# EAGLE design esptoy_v124 (EAGLE 7.3.0)
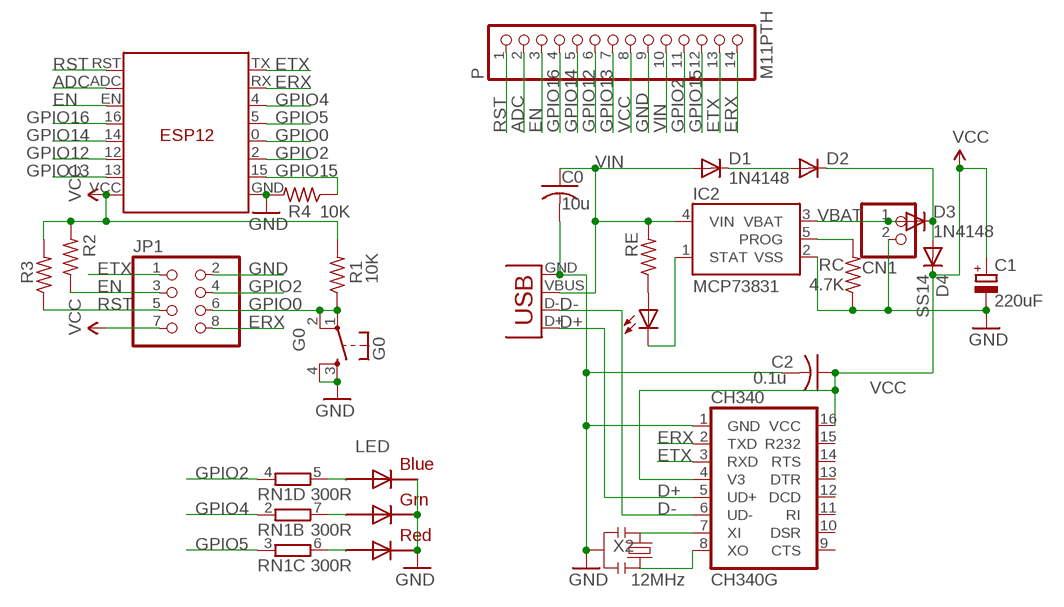
[diagram p0: schematic, sheet 1]

## Parts
C0  10u  C-USC0805K  [C0805K]
C1  220uF  CPOL-EUD  [PANASONIC_D]
C2  0.1u  C-USC0603K  [C0603K]
CH340  CH340G  [SO16]
CHG  0805  LEDCHIPLED_0805  [CHIPLED_0805]
CN1  JST_2PIN-SMT-RA  [JST-PH-2-SMT-RA]
D1  1N4148  DIODE-MINIMELF  [MINIMELF]
D2  DIODE-MINIMELF  [MINIMELF]
D3  1N4148  DIODE-MINIMELF  [MINIMELF]
D4  SS14  DIODE-DO-214AC  [DO-214AC]
G0  G0  TAC_SWITCHSMD  [TACTILE_SWITCH_SMD]
IC2  MCP73831  [SOT23-5]
JP1  PINHD-2X4  [2X04]
LED  RGBLED5050  [RGBLED5050]
P  M11PTH  PINHD-1X14-CB  [1X14-CB]
R1  10K  R-US_R0603  [R0603]
R2  R-US_R0603  [R0603]
R3  R-US_R0603  [R0603]
R4  10K  R-US_R0603  [R0603]
RC  4.7K  R-US_R0805  [R0805]
RE  R-US_R0603  [R0603]
RN1  300R  4R-NEXB38V  [EXB38V]
U$1  ESP12  [ESP12]
X2  12MHz  RESONATORSMD  [RESONATOR-SMD]
X3  USB-MICROB  [USB-MICROB]

## Nets
ADC: P.2 U$1.ADC
D+: CH340.5(UD+) X3.D+
D-: CH340.6(UD-) X3.D-
EN: JP1.3 P.3 R2.1 U$1.EN
ERX: CH340.2(TXD) JP1.8 P.14 U$1.RX
ETX: CH340.3(RXD) JP1.1 P.13 U$1.TX
GND: C0.2 C1.- C2.2 CH340.1(GND) CN1.2 G0.3 G0.4 IC2.2(VSS) JP1.2 LED.4(BLUE_C) LED.5(RED_C) LED.6(GREEN_C) P.9 R4.2 RC.1 U$1.GND X2.2 X3.GND
GPIO0: G0.1 G0.2 JP1.6 R1.1 U$1.0(G0)
GPIO2: JP1.4 P.11 RN1.4 U$1.2(G2)
GPIO4: RN1.2 U$1.4(G4)
GPIO5: RN1.3 U$1.5(G5)
GPIO12: P.6 U$1.12(G12)
GPIO13: P.7 U$1.13(G13)
GPIO14: P.5 U$1.14(G14)
GPIO15: P.12 R4.1 U$1.15(G15)
GPIO16: P.4 U$1.16(G16)
N$1: D1.C D2.A
N$2: LED.3(BLUE_A) RN1.5
N$3: IC2.5(PROG) RC.2
N$4: CHG.A RE.1
N$5: CHG.C IC2.1(STAT)
N$6: LED.1(GREEN_A) RN1.7
N$7: LED.2(RED_A) RN1.6
N$8 [power]: D2.C D3.C D4.A
N$11: CH340.7(XI) X2.1
N$13: CH340.8(XO) X2.3
RST: JP1.5 P.1 R3.1 U$1.RST
VBAT [power]: CN1.1 D3.A IC2.3(VBAT)
VCC [power]: C1.+ C2.1 CH340.4(V3) CH340.16(VCC) D4.C JP1.7 P.8 R1.2 R2.2 R3.2 U$1.VCC
VIN [power]: C0.1 D1.A IC2.4(VIN) P.10 RE.2 X3.VBUS
Unconnected: CH340.9(CTS) CH340.10(DSR) CH340.11(RI) CH340.12(DCD) CH340.13(DTR) CH340.14(RTS) CH340.15(R232) RN1.1 RN1.8

## Library data of the parts
C0 = adafruit2013:C-US: CAPACITOR, American symbol
C1 = rcl:CPOL-EU: POLARIZED CAPACITOR, European symbol
C2 = adafruit:C-US: CAPACITOR, American symbol
CH340 = SparkFunNew:CH340
CHG = led:LED: LED OSRAM: - CHIPLED LG R971, LG N971, LY N971, LG Q971, LY Q971, LO R971, LY R971 LH N974, LH R974 LS Q976, LO Q976, LY Q976 LO Q996 - Hyper CHIPLED LW Q18S LB Q993, LB Q99A, LB R99A - SideLED LS A670, LO A670, LY A670, LG A670, LP A670 LB A673, LV A673, LT A673, LW A673 LH A674 LY A675 LS A676, LA A676, LO A676, LY A676, LW A676 LS A679, LY A679, LG A679 - Hyper Micro SIDELED® LS Y876, LA Y876, LO Y876, LY Y876 LT Y87S - SmartLED LW L88C, LW L88S LB L89C, LB L89S, LG L890 LS L89K, LO L89K, LY L89K LS L896, LA L896, LO L896, LY L896 - TOPLED LS T670, LO T670, LY T670, LG T670, LP T670 LSG T670, LSP T670, LSY T670, LOP T670, LYG T670 LG T671, LOG T671, LSG T671 LB T673, LV T673, LT T673, LW T673 LH T674 LS T676, LA T676, LO T676, LY T676, LB T676, LH T676, LSB T676, LW T676 LB T67C, LV T67C, LT T67C, LS T67K, LO T67K, LY T67K, LW E67C LS E67B, LA E67B, LO E67B, LY E67B, LB E67C, LV E67C, LT E67C LW T67C LS T679, LY T679, LG T679 LS T770, LO T770, LY T770, LG T770, LP T770 LB T773, LV T773, LT T773, LW T773 LH T774 LS E675, LA E675, LY E675, LS T675 LS T776, LA T776, LO T776, LY T776, LB T776 LHGB T686 LT T68C, LB T68C - Hyper Mini TOPLED® LB M676 - Mini TOPLED Santana® LG M470 LS M47K, LO M47K, LY M47K Source: http://www.osram.convergy.de LUXEON: - LUMILED® LXK2-PW12-R00, LXK2-PW12-S00, LXK2-PW14-U00, LXK2-PW14-V00 LXK2-PM12-R00, LXK2-PM12-S00, LXK2-PM14-U00 LXK2-PE12-Q00, LXK2-PE12-R00, LXK2-PE12-S00, LXK2-PE14-T00, LXK2-PE14-U00 LXK2-PB12-K00, LXK2-PB12-L00, LXK2-PB12-M00, LXK2-PB14-N00, LXK2-PB14-P00, LXK2-PB14-Q00 LXK2-PR12-L00, LXK2-PR12-M00, LXK2-PR14-Q00, LXK2-PR14-R00 LXK2-PD12-Q00, LXK2-PD12-R00, LXK2-PD12-S00 LXK2-PH12-R00, LXK2-PH12-S00 LXK2-PL12-P00, LXK2-PL12-Q00, LXK2-PL12-R00 Source: www.luxeon.com KINGBRIGHT: KA-3528ASYC Source: www.kingbright.com
CN1 = adafruit:JST_2PIN: JST 2-Pin Connectors of various flavors SMT-RA (S2B-PH-SM4) 4UConnector #17311 SMT (B2B-PH-SM4) THM-RA (S2B-PH) THM (B2B-PH)
D1-D4 = diode:DIODE-: DIODE
G0 = SparkFunNew:TAC_SWITCH: Momentary Switch Button commonly used for reset or general input. Spark Fun Electronics SKU : COM-00097
IC2 = SparkFunNew:MCP73831: Microchip's MCP73831 Miniature single cell, fully integrated Li-Ion, Li-polymer charge management controller http://ww1.microchip.com/downloads/en/DeviceDoc/21984a.pdf
JP1 = pinhead:PINHD-2X4: PIN HEADER
LED = adafruit:RGBLED: For 5050 RGB LEDs, the order of the LEDs may vary from one manufacturer to another!
P = adafruit:PINHD-1X14: PIN HEADER
R1-R4 RE = adafruit (picker 的冲突副本 2014-10-29):R-US_: RESISTOR, American symbol
RC = adafruit2013:R-US_: RESISTOR, American symbol
RN1 = resistor-dil:4R-N: Array Chip Resistor Source: RS Component / Phycomp; OC_FARNELL: unknown; OC_NEWARK: unknown
U$1 = JeeParts:ESP12
X2 = SparkFunNew:RESONATOR: Resonator Small SMD resonator. This is the itty bitty 10/20MHz resonators with built in caps. CSTCE10M0G55 and CSTCE20M0V53. Footprint has been reviewed closely but hasn't been tested yet.
X3 = SparkFunNew:USB: USB Connectors USB-B-PTH is fully proven SKU : PRT-00139 USB-miniB is fully proven SKU : PRT-00587 USB-A-PCB is untested. USB-A-H is throughly reviewed, but untested. Spark Fun Electronics SKU : PRT-00437 USB-B-SMT is throughly reviewed, but untested. Needs silkscreen touching up. USB-A-S has not been used/tested USB-MB-H has not been used/tested

## Net classes
0 default: width 0.178 mm, clearance 0.178 mm
1 power: width 0.254 mm, clearance 0.178 mm

## Board
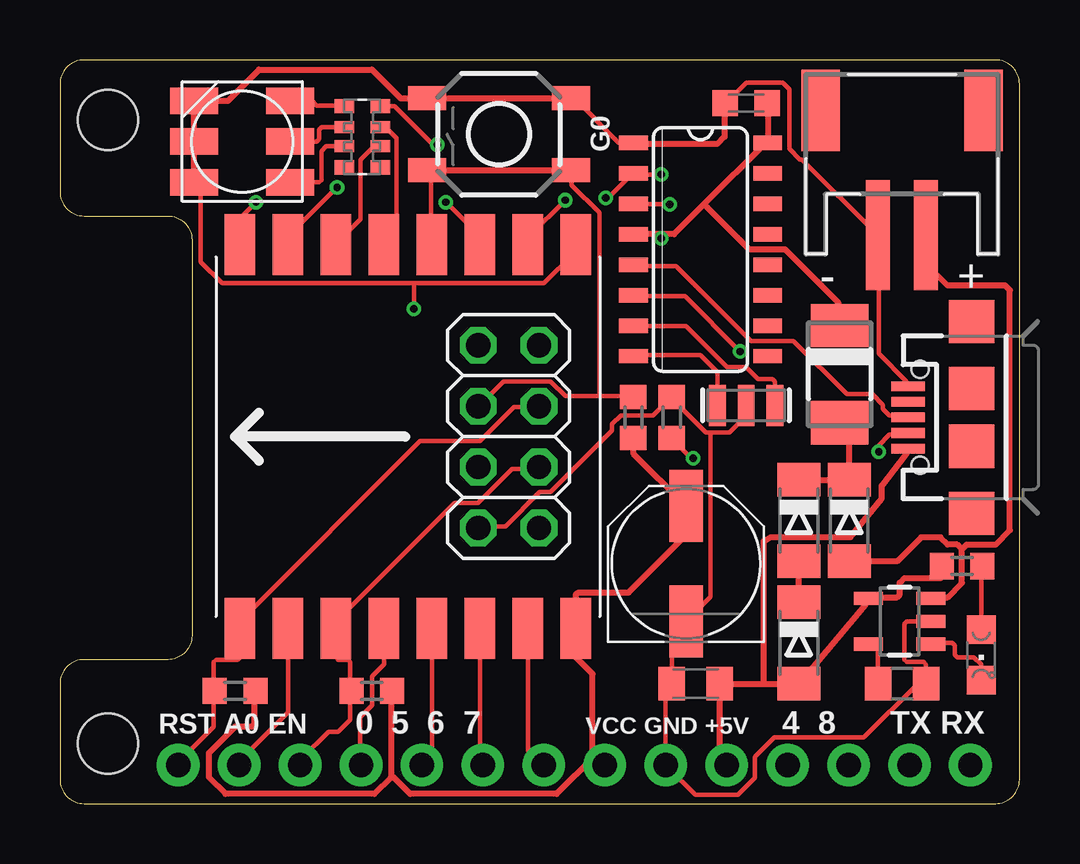
[diagram p1: board, top side]
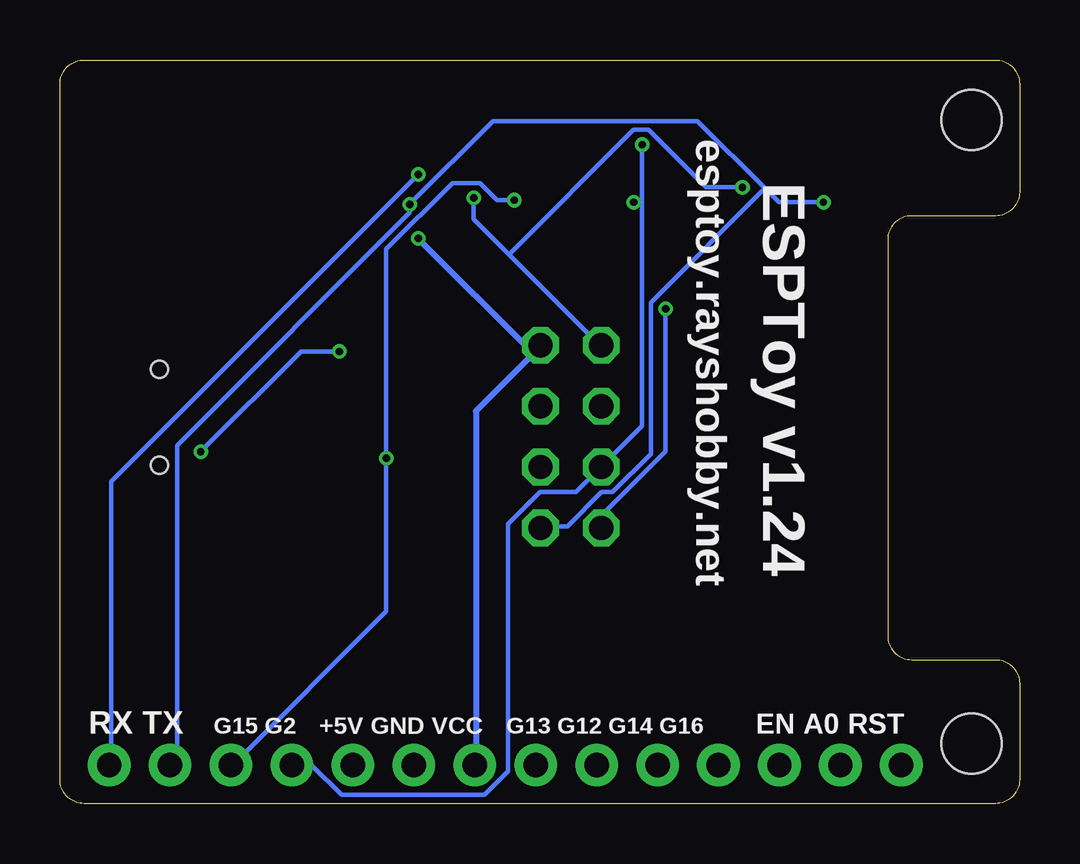
[diagram p2: board, bottom side, seen from below]

Size 40 x 31 mm. Coordinates in mm from the lower left corner, seen from the top.
Outline: 40,1 40,30 arc90 39,31 1,31 arc90 0,30 0,25.5 arc90 1,24.5 4.5,24.5 arc-90 5.5,23.5 5.5,7 arc-90 4.5,6 1,6 arc90 0,5 0,1 arc90 1,0 39,0 arc90 40,1
Copper layers (1*16): Top 0.035mm / dielectric 1.5mm / Bottom 0.035mm
Design rules "Fusion_eagle_rule_v1.1 *": minimum track width 6mil, minimum drill 12mil, track to track 6mil, track to pad 6mil, pad to pad 6mil, via to via 6mil, smd to smd 0mil, copper to edge 10mil, drill to drill 10mil, minimum pad ring 10mil, minimum via ring 6mil, stop-mask expansion 2mil, vias tented up to drill 100mil, thermal gap 40mil
Holes 2.5 mm at 2,28.5 2,2.5
tRestrict: area 0.2,26.7 to 3.8,30.3; area 0.2,0.7 to 3.8,4.3
vRestrict: area 4.2,2.9 to 38.8,3.9

### Footprints (pad centres in the part's own frame; a part is rotated, then mirrored left to right if it is on the bottom)
C0805K = smd 1.1 x 1.4: 1 -1,0; 2 1,0
PANASONIC_D = smd 3 x 1.4: + 2.4,0; - -2.4,0
C0603K = smd 1.05 x 1.08: 1 -0.875,0; 2 0.875,0
SO16 = smd 0.6 x 1.2: 1 -4.445,-2.8; 2 -3.175,-2.8; 3 -1.905,-2.8; 4 -0.635,-2.8; 5 0.635,-2.8; 6 1.905,-2.8; 7 3.175,-2.8; 8 4.445,-2.8; 9 4.445,2.8; 10 3.175,2.8; 11 1.905,2.8; 12 0.635,2.8; 13 -0.635,2.8; 14 -1.905,2.8; 15 -3.175,2.8; 16 -4.445,2.8
CHIPLED_0805 = smd 1.2 x 1.2: A 0,-1.05; C 0,1.05
JST-PH-2-SMT-RA = smd 1 x 4.6: 1 1,-3.7; 2 -1,-3.7 | smd 1.6 x 3.4: NC1 -3.4,1.5; NC2 3.4,1.5
MINIMELF = smd 1.4 x 1.8: A 1.7,0; C -1.7,0
DO-214AC = smd 1.8 x 2.4: A 2.025,0; C -2.025,0
TACTILE_SWITCH_SMD = smd 1.6 x 1: 1 -3,1.5; 2 3,1.5; 3 -3,-1.5; 4 3,-1.5
SOT23-5 = smd 0.55 x 1.2: 1 -0.95,-1.3; 2 0,-1.3; 3 0.95,-1.3; 4 0.95,1.3; 5 -0.95,1.3
2X04 = drill 1.016 octagon: 1 -3.81,-1.27; 2 -3.81,1.27; 3 -1.27,-1.27; 4 -1.27,1.27; 5 1.27,-1.27; 6 1.27,1.27; 7 3.81,-1.27; 8 3.81,1.27
RGBLED5050 = smd 2 x 1.1: 1 -2,1.7; 2 -2,0; 3 -2,-1.7; 4 2,-1.7; 5 2,0; 6 2,1.7
1X14-CB = drill 1.016 pad 1.778: 1 -16.51,0; 2 -13.97,0; 3 -11.43,0; 4 -8.89,0; 5 -6.35,0; 6 -3.81,0; 7 -1.27,0; 8 1.27,0; 9 3.81,0; 10 6.35,0; 11 8.89,0; 12 11.43,0; 13 13.97,0; 14 16.51,0
R0603 = smd 1 x 1.1: 1 -0.85,0; 2 0.85,0
R0805 = smd 1.1 x 1.4: 1 -1,0; 2 1,0
EXB38V = smd 0.6 x 0.8: 1 -1.275,-0.75; 4 1.275,-0.75; 5 1.275,0.75; 8 -1.275,0.75 | smd 0.5 x 0.8: 2 -0.4,-0.75; 3 0.4,-0.75; 6 0.4,0.75; 7 -0.4,0.75
ESP12 = smd 2.54 x 1.27: 0 8,-2; 2 8,-4; 4 8,2; 5 8,0; 12 -8,-4; 13 -8,-6; 14 -8,-2; 15 8,-6; 16 -8,0; ADC -8,4; EN -8,2; GND 8,-8; RST -8,6; RX 8,4; TX 8,6; VCC -8,-8
RESONATOR-SMD = smd 0.7 x 1.7: 1 -1.2,0; 2 0,0; 3 1.2,0
USB-MICROB = smd 0.4 x 1.4: D+ 0,2.65; D- -0.65,2.65; GND 1.3,2.65; ID 0.65,2.65; VBUS -1.3,2.65 | smd 1.8 x 1.9: MT1 -4,0; MT2 4,0; MT3 1.2,0; MT4 -1.2,0 | hole 0.7: -2,2.15; 2,2.15

### Placement (x,y rotation side)
C0  26.5,5 180 top
C1  26.1,10 90 top
C2  28.6,29.2 180 top
CH340  26.7,23.1 270 top
CHG  38.4,6.2 180 top
CN1  35.1,27.4 0 top
D1  30.8,6.7 270 top
D2  30.8,11.8 270 top
D3  32.9,11.8 270 top
D4  32.5,17.9 270 top
G0  18.3,27.9 180 top
IC2  35,7.6 90 top
JP1  18.7,15.3 90 top
LED  7.6,27.6 180 top
P  21.44,1.6 0 top
R1  23.9,16.1 270 top
R2  13,4.7 0 top
R3  7.3,4.7 0 top
R4  25.5,16.1 90 top
RC  35.1,5 180 top
RE  37.6,9.9 180 top
RN1  12.6,27.8 90 top
U$1  13.5,15.3 90 top
X2  28.6,16.6 180 top
X3  38,16.1 90 top

### Tracks (layer width: path | path; a pad name or v marks a point on that pad's centre or on a via)
ADC
  Top 0.178: U$1.ADC 9.5,3.8 7.5,1.8 7.5,1.6 P.2
D+
  Top 0.178: CH340.5 23.91,22.4 25.69,22.4 28.8,19.29 30.58,19.29 32.8,17.07 33.87,17.07 34.31,16.62 34.31,16.45 34.58,16.18 35.29,16.18 X3.D+
D-  (via drill 0.3)
  Top 0.178: v28.35,18.85 26.04,21.16 23.91,21.16 CH340.6 | v34.13,14.67 34.13,14.94 34.58,15.38 35.29,15.38 X3.D-
  Bottom 0.178: v28.35,18.85 29.95,18.85 v34.13,14.67
EN
  Top 0.178: 12.1,4.7 12.1,3.5 11.6,3 11.2,3 10.1,1.9 10.1,1.6 P.3 | 12.1,4.7 12.1,5.9 12,6 11.6,6 11.5,6.1 U$1.EN 11.55,7.38 11.55,7.64 16.44,12.54 17.42,12.54 18.84,13.96 19.91,13.96 JP1.3 | 12.1,4.7 R2.1
ERX  (via drill 0.3)
  Top 0.178: v22.75,25.25 22.84,25.25 23.82,26.23 CH340.2 23.91,26.23 v25.07,26.23 | v11.55,25.69 9.51,23.65 9.51,23.38 U$1.RX
  Bottom 0.178: v22.75,25.25 22.75,24.36 21.29,22.89 | 21.29,22.89 17.51,19.11 JP1.8 | v11.55,25.69 13.06,25.69 15.46,28.09 16.09,28.09 21.29,22.89 | v25.07,26.23 37.87,13.42 37.87,1.6 P.14
ETX  (via drill 0.3)
  Top 0.178: v25.42,24.98 23.91,24.98 CH340.3 | v8.17,25.07 7.55,24.45 7.55,23.38 U$1.TX
  Bottom 0.178: P.13 35.38,1.6 35.11,1.87 35.11,14.94 25.42,24.62 v25.42,24.98 21.95,28.45 13.42,28.45 10.62,25.65 | v8.17,25.07 10.04,25.07 10.62,25.65 | 10.62,25.65 15.38,20.89 15.38,14.58 16.98,12.98 17.42,12.98 18.84,11.56 19.91,11.56 JP1.1
GND  (via drill 0.3)
  Top 0.178: IC2.2 35.3,7.6 35.2,7.5 35.2,6 35.3,5.9 36,5.9 36.1,5.8 RC.1 36.09,4.98 35.73,4.98 33.51,2.76 29.78,2.76 28.98,1.96 28.98,1.07 28.27,0.36 26.49,0.36 25.33,1.51 P.9 25.24,1.69 25.24,4.8 25.42,4.98 C0.2 25.51,5.07 25.51,7.02 26.04,7.56 C1.- 26.13,7.64 27.11,8.62 27.11,15.47 | 25.51,16.98 R4.2 | 27.11,15.47 27.91,15.47 28.53,16.09 28.53,16.54 X2.2 | 27.11,15.47 26.93,15.47 25.51,16.89 R4.2 | JP1.2 17.51,11.56 18.57,11.56 20,12.98 20.44,12.98 23.02,15.56 23.02,15.82 23.38,16.18 24.71,16.18 25.42,16.89 R4.2 | X3.GND 35.29,17.42 35.29,17.6 34.13,18.76 34.13,23.65 CN1.2 34.04,23.74 30.93,26.85 30.84,26.85 30.4,27.29 30.4,29.78 30.13,30.05 28.62,30.05 27.82,29.25 C2.2 | 14.75,21.69 6.75,21.69 5.86,22.58 5.86,25.51 5.6,25.78 LED.6 | 14.75,21.69 20.18,21.69 21.42,22.94 21.42,23.29 U$1.GND | CH340.1 23.82,27.56 23.29,27.56 21.42,29.43 G0.3 | 14.75,21.69 v14.75,20.62
  Top 0.254: LED.6 LED.5 LED.4 7,29.3 8.3,30.6 13,30.6 14.2,29.4 G0.4 G0.3 | CH340.1 23.9,27.5 27.4,27.5 27.7,27.8 27.7,29.2 C2.2
  Bottom 0.178: v14.75,20.62 14.75,14.67 17.42,12 17.42,11.56 JP1.2
GPIO0
  Top 0.178: U$1.0 15.46,23.38 15.46,26.31 G0.2 | 22.49,16.98 21.06,16.98 20.44,17.6 18.49,17.6 17.51,16.62 JP1.6 | 22.49,16.98 23.82,16.98 R1.1 | 22.49,16.98 22.49,24.62 21.33,25.78 21.33,26.31 G0.1
  Top 0.254: G0.2 G0.1
GPIO2  (via drill 0.3)
  Top 0.178: v15.73,27.47 15.55,27.47 13.95,29.07 13.42,29.07 RN1.4 | v16.09,25.07 17.42,23.74 17.42,23.38 U$1.2
  Bottom 0.178: 30.31,1.6 P.11 30.22,1.6 29.51,1.6 28.27,0.36 22.31,0.36 21.33,1.33 21.33,11.65 20,12.98 18.49,12.98 17.51,13.96 JP1.4 17.42,14.05 15.73,15.73 15.73,25.07 | 15.73,25.07 v15.73,27.47 | 15.73,25.07 v16.09,25.07
GPIO4
  Top 0.178: RN1.2 13.33,27.38 13.06,27.38 12.53,26.85 12.53,24.36 11.55,23.38 U$1.4
GPIO5
  Top 0.178: RN1.3 13.42,28.18 13.6,28.18 14.04,27.74 14.04,23.91 13.51,23.38 U$1.5
GPIO12
  Top 0.178: U$1.12 17.5,1.7 17.6,1.6 P.6
GPIO13
  Top 0.178: U$1.13 19.5,2.2 20.1,1.6 P.7
GPIO14
  Top 0.178: U$1.14 15.5,2 P.5
GPIO15  (via drill 0.3)
  Top 0.178: v26.4,14.4 26.31,14.4 25.51,15.2 R4.1 | v21.06,25.16 19.55,23.65 19.55,23.38 U$1.15
  Bottom 0.178: P.12 32.8,1.6 26.4,8 v26.4,14.4 26.4,23.11 23.64,25.87 22.49,25.87 21.78,25.16 v21.06,25.16
GPIO16
  Top 0.178: P.4 12.5,1.6 12.5,3.6 13,4.1 13,5.3 13.5,5.8 U$1.16
N$1
  Top 0.254: D1.C D2.A
N$2
  Top 0.178: LED.3 10.5,29.3 10.7,29.1 11.8,29.1 RN1.5
N$3
  Top 0.178: RC.2 34.1,6.65 IC2.5
N$4
  Top 0.178: CHG.A 38.4,9.9 RE.1
N$5
  Top 0.178: CHG.C 38.4,5.8 38.1,6.1 37.4,6.1 37.3,6.2 37.3,6.6 37.2,6.7 36.4,6.7 IC2.1
N$6
  Top 0.178: RN1.7 11.1,27.4 10.9,27.2 10.9,26 10.8,25.9 LED.1
N$7
  Top 0.178: RN1.6 10.9,28.2 10.8,28.1 10.8,27.7 10.7,27.6 LED.2
N$8
  Top 0.254: D2.C D3.C 32.9,15.88 D4.A
N$11
  Top 0.178: X2.1 29.8,17.6 29.7,17.7 29.1,17.7 28.6,18.2 27.8,18.2 26.1,19.9 23.9,19.9 CH340.7
N$13
  Top 0.178: X2.3 27.4,18 26.7,18.7 23.9,18.7 CH340.8
RST
  Top 0.178: 6.4,4.7 6.4,3.2 5,1.8 5,1.6 P.1 | 6.4,4.7 6.4,5.9 6.5,6 7.4,6 7.5,6.1 U$1.RST 7.55,7.38 7.55,7.64 15.02,15.11 17.51,15.11 18.93,16.54 19.91,16.54 JP1.5 | 6.4,4.7 R3.1
VBAT
  Top 0.254: 37.6,10.6 37.8,10.8 39,10.8 39.6,11.4 39.6,21.4 39.4,21.6 37,21.6 36.1,22.5 CN1.1 | 37.6,10.6 37.6,9.2 37,8.6 36.4,8.6 IC2.3 | D3.A 34.9,10.1 35.9,11.1 36.7,11.1 37,10.8 37.4,10.8 37.6,10.6
VCC  (via drill 0.3)
  Top 0.254: R3.2 8.1,4.7 8.1,3.3 8,3.2 7.3,3.2 6.2,2.1 6.2,1.1 6.9,0.4 13.1,0.4 13.8,1.1 | 13.8,1.1 13.8,4.7 R2.2 | 22.3,2 P.8 22.3,2 | 22.3,2 22.2,2.1 22.2,5.4 21.5,6.1 U$1.VCC 21.5,8.7 21.6,8.8 23.7,8.8 26.1,11.2 C1.+ 26.04,12.45 23.91,14.58 23.91,15.2 R1.2 | 22.3,2 20.7,0.4 14.6,0.4 13.9,1.1 13.8,1.1 | C2.1 29.5,29.2 CH340.16 29.42,27.56 26.84,24.98 | 25.07,23.74 25.6,23.74 26.84,24.98 | 25.07,23.74 CH340.4 | 26.84,24.98 28.71,23.11 30.22,23.11 32.44,20.89 32.44,20 D4.C | v25.07,23.56 25.07,23.74
  Bottom 0.254: P.8 22.66,1.6 22.66,16.36 20,19.02 JP1.7 20.35,18.85 v25.07,23.56
VIN
  Top 0.254: P.10 27.7,1.6 27.5,1.8 C0.1 29.34,5 | 29.34,5 D1.A 30.88,5.07 33.49,8.18 33.69,8.45 IC2.4 33.7,8.6 34.9,8.6 35,8.7 35,9.2 35.2,9.4 36.7,9.4 36.7,9.9 RE.2 | 29.34,5 29.34,10.94 29.62,11.11 32.95,11.11 34.26,12.71 34.26,13.25 35.29,14.58 35.29,14.76 X3.VBUS

### Text on the board
tPlace: RST A0 EN | 0 5 6 7 | VCC GND +5V | 4 8 | TX RX
bPlace: EN A0 RST | G13 G12 G14 G16 | +5V GND VCC | G15 G2 | RX TX
bNames: esptoy.rayshobby.net | ESPToy v1.24